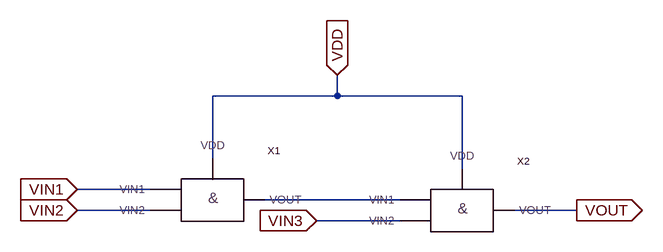
[diagram p0: schematic dimatripleand.asc]
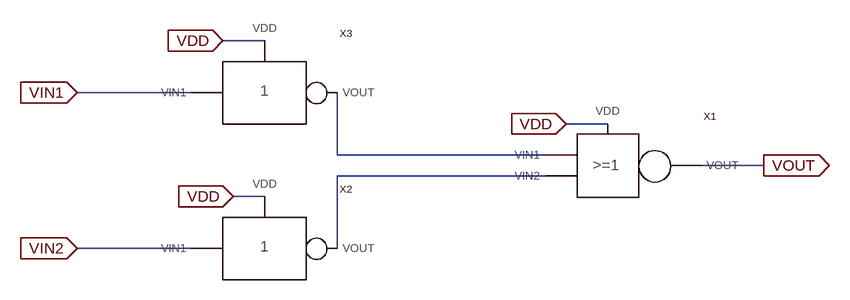
[diagram p1: sub-circuit dimaand.asc]
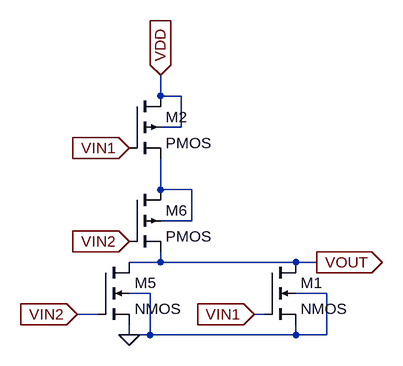
[diagram p2: sub-circuit dimanor.asc]
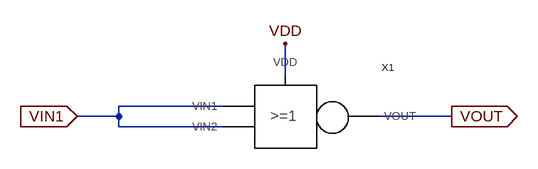
[diagram p3: sub-circuit dimanot.asc]
dimatripleand.asc, the LTspice schematic file:
Version 4
SHEET 1 880 680
WIRE 256 0 256 -32
WIRE 256 0 64 0
WIRE 448 0 256 0
WIRE 64 96 64 0
WIRE 448 112 448 0
WIRE -32 144 -144 144
WIRE 352 160 144 160
WIRE -32 176 -144 176
WIRE 624 176 528 176
WIRE 352 192 224 192
FLAG 224 192 VIN3
IOPIN 224 192 In
FLAG -144 144 VIN1
IOPIN -144 144 In
FLAG -144 176 VIN2
IOPIN -144 176 In
FLAG 256 -32 VDD
IOPIN 256 -32 In
FLAG 624 176 VOUT
IOPIN 624 176 Out
SYMBOL dimaand 64 160 R0
SYMATTR InstName X1
SYMBOL dimaand 448 176 R0
SYMATTR InstName X2

dimaand.asc, the sub-circuit schematic file:
Version 4
SHEET 1 880 680
WIRE -176 0 -240 0
WIRE -288 80 -464 80
WIRE 352 128 288 128
WIRE -64 176 -64 80
WIRE 256 176 -64 176
WIRE 592 192 496 192
WIRE 256 208 -64 208
WIRE -176 240 -224 240
WIRE -288 320 -464 320
WIRE -64 320 -64 208
FLAG -240 0 VDD
IOPIN -240 0 In
FLAG -464 320 VIN2
IOPIN -464 320 In
FLAG -464 80 VIN1
IOPIN -464 80 In
FLAG 592 192 VOUT
IOPIN 592 192 Out
FLAG 288 128 VDD
IOPIN 288 128 In
FLAG -224 240 VDD
IOPIN -224 240 In
SYMBOL dimanor 352 176 R0
SYMATTR InstName X1
SYMBOL dimanot -176 320 R0
SYMATTR InstName X2
SYMBOL dimanot -176 80 R0
SYMATTR InstName X3

dimanor.asc, the sub-circuit schematic file:
Version 4
SHEET 1 880 680
WIRE 464 64 464 32
WIRE 496 64 464 64
WIRE 496 112 496 64
WIRE 496 112 464 112
WIRE 464 208 464 160
WIRE 512 208 464 208
WIRE 512 256 512 208
WIRE 512 256 464 256
WIRE 464 320 464 304
WIRE 464 320 416 320
WIRE 672 320 464 320
WIRE 704 320 672 320
WIRE 448 368 416 368
WIRE 720 368 672 368
WIRE 368 400 336 400
WIRE 624 400 608 400
WIRE 416 432 416 416
WIRE 448 432 448 368
WIRE 448 432 416 432
WIRE 672 432 672 416
WIRE 672 432 448 432
WIRE 720 432 720 368
WIRE 720 432 672 432
FLAG 416 144 VIN1
IOPIN 416 144 In
FLAG 416 288 VIN2
IOPIN 416 288 In
FLAG 608 400 VIN1
IOPIN 608 400 In
FLAG 336 400 VIN2
IOPIN 336 400 In
FLAG 416 432 0
FLAG 464 32 VDD
IOPIN 464 32 In
FLAG 704 320 VOUT
IOPIN 704 320 Out
SYMBOL nmos4 368 320 R0
SYMATTR InstName M5
SYMATTR Value2 l=90n w=200n
SYMBOL nmos4 624 320 R0
SYMATTR InstName M1
SYMATTR Value2 l=90n w=200n
SYMBOL pmos4 416 64 R0
SYMATTR InstName M2
SYMATTR Value2 l=90n w=400n
SYMBOL pmos4 416 208 R0
SYMATTR InstName M6
SYMATTR Value2 l=90n w=400n

dimanot.asc, the sub-circuit schematic file:
Version 4
SHEET 1 880 680
WIRE 272 112 272 64
WIRE 176 160 16 160
WIRE 16 176 16 160
WIRE 16 176 -48 176
WIRE 528 176 416 176
WIRE 16 192 16 176
WIRE 176 192 16 192
FLAG -48 176 VIN1
IOPIN -48 176 In
FLAG 272 64 VDD
FLAG 528 176 VOUT
IOPIN 528 176 Out
SYMBOL dimanor 272 160 R0
SYMATTR InstName X1

The netlist it stands for:
* dimatripleand.asc
XX1 VIN1 VIN2 VDD N001 dimaand
XX2 N001 VIN3 VDD VOUT dimaand

* block symbol definitions
.subckt dimaand VIN1 VIN2 VDD VOUT
XX1 N001 N002 VDD VOUT dimanor
XX2 VIN2 VDD N002 dimanot
XX3 VIN1 VDD N001 dimanot
.ends dimaand

.subckt dimanor VIN1 VIN2 VDD VOUT
M5 VOUT VIN2 0 0 NMOS l=90n w=200n
M1 VOUT VIN1 0 0 NMOS l=90n w=200n
M2 VDD VIN1 N001 VDD PMOS l=90n w=400n
M6 N001 VIN2 VOUT N001 PMOS l=90n w=400n
.ends dimanor

.subckt dimanot VIN1 VDD VOUT
XX1 VIN1 VIN1 VDD VOUT dimanor
.ends dimanot

.model NMOS NMOS
.model PMOS PMOS
.lib standard.mos
.backanno
.end